# EAGLE design node (EAGLE 8.2.2)
MySensors node based on ATMEGA328P-PU
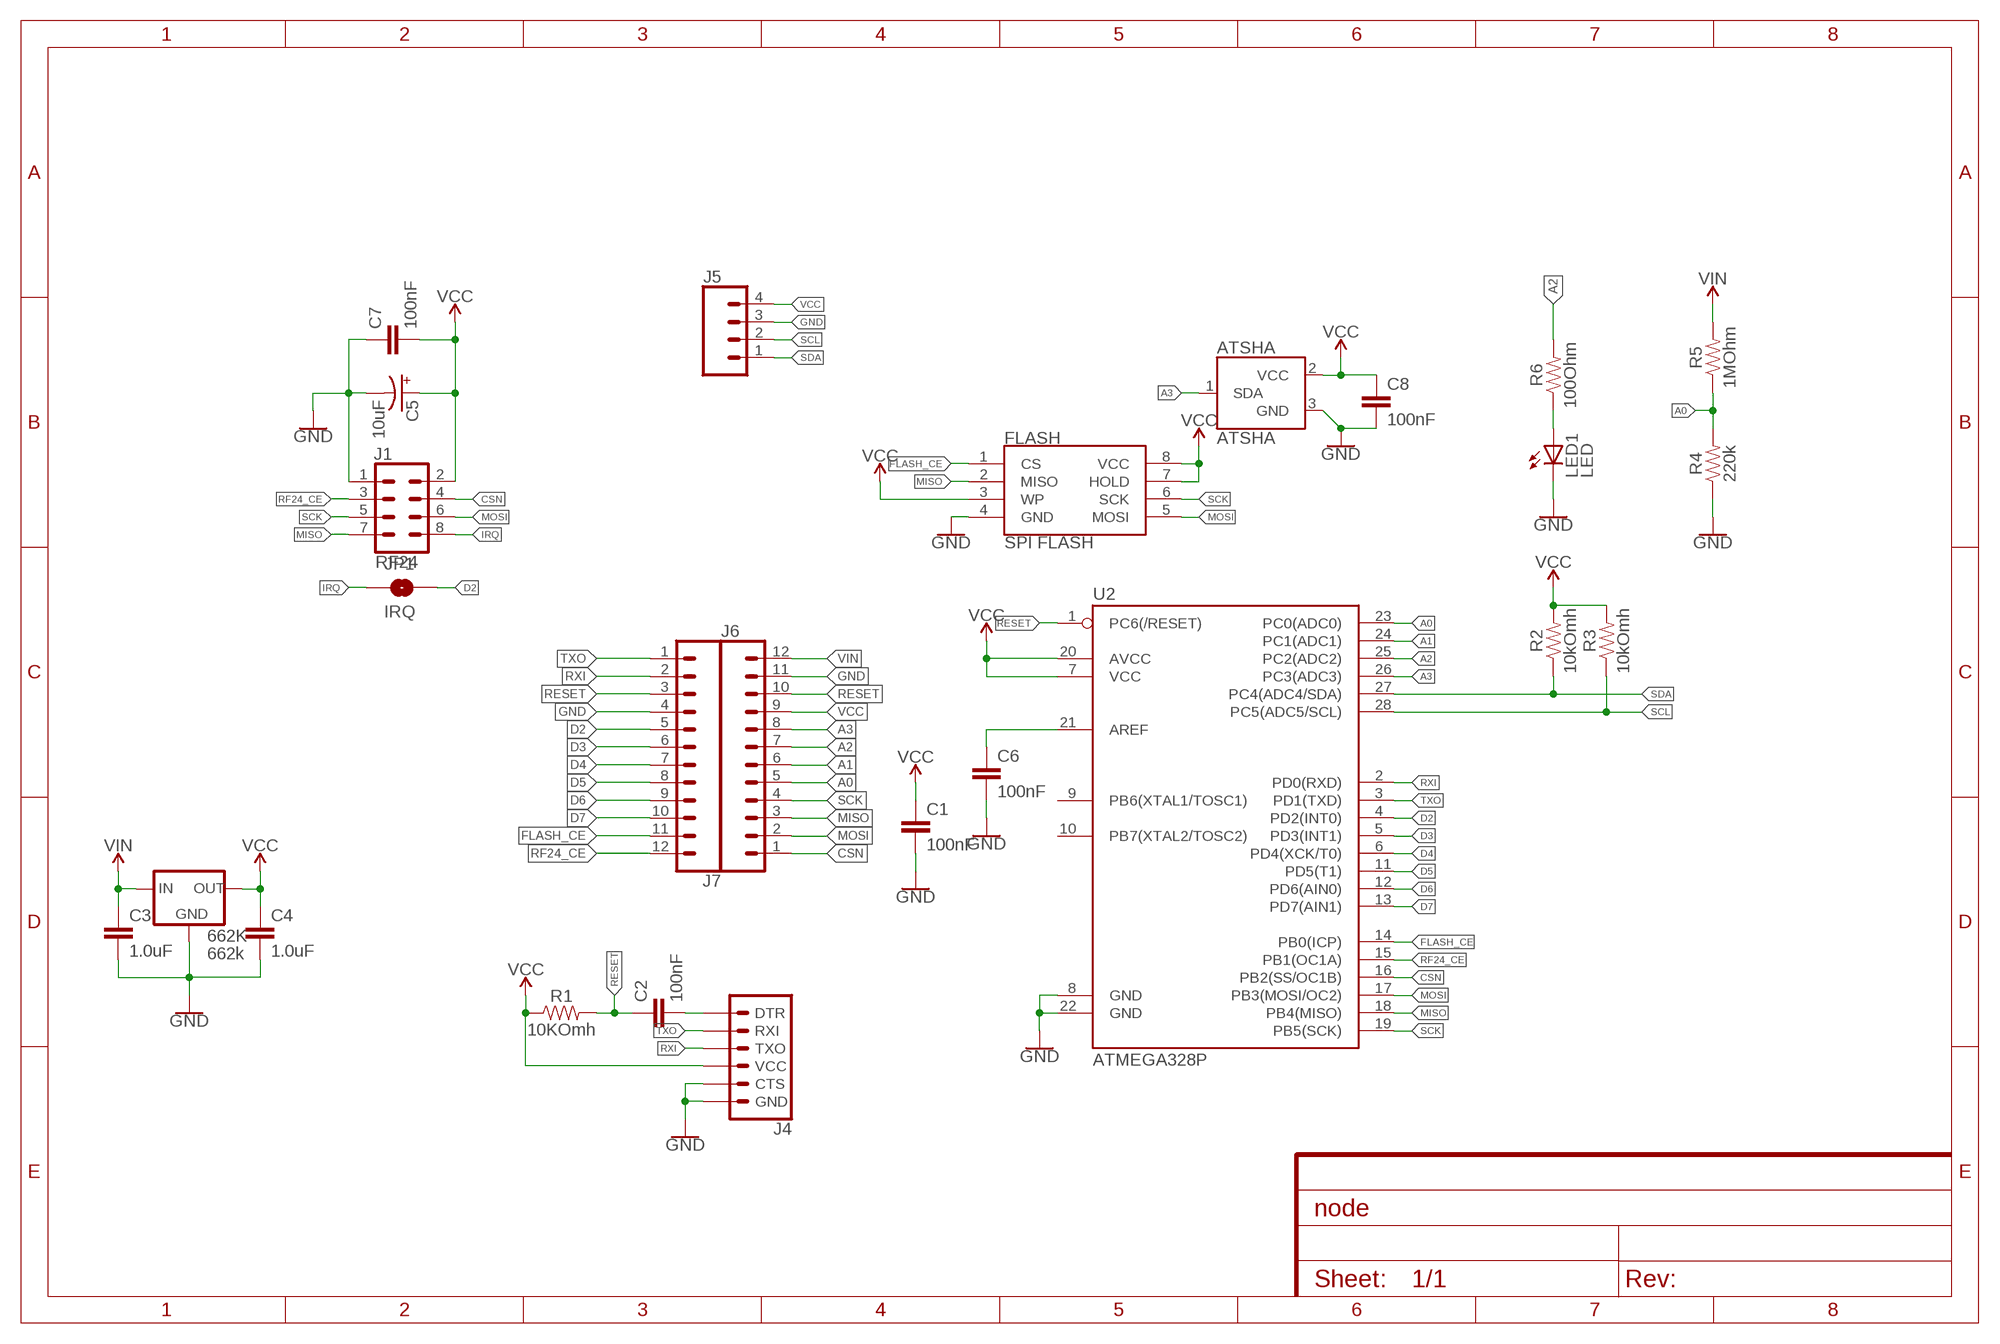
[diagram p0: schematic, sheet 1]

## Parts
662K  662k  XC63FPM  [SOT23]
ATSHA  ATSHA  ATSHA204-TSU  [SOT23-3]
C1  100nF  10UF-0805-10V-10%  [0805]
C2  100nF  10UF-0805-10V-10%  [0805]
C3  1.0uF  1.0UF-0805-25V-10%  [0805]
C4  1.0uF  1.0UF-0805-25V-10%  [0805]
C5  10uF  10UF-POLAR-RADIAL-2.5MM-25V-20%  [CPOL-RADIAL-2.5MM-5MM]
C6  100nF  10UF-0805-10V-10%  [0805]
C7  100nF  10UF-0805-10V-10%  [0805]
C8  100nF  10UF-0805-10V-10%  [0805]
FLASH  SPI FLASH  SPI_FLASH-X25XXSMD  [SO08]
J1  RF24  CONN_04X2  [2X4]
J4  6_PIN_SERIAL_TARGET  [1X06]
J5  CONN_04  [1X04]
J6  CONN_12  [1X12]
J7  CONN_12  [1X12]
JP1  IRQ  JUMPER-SMT_2_NO_NO-SILK  [SMT-JUMPER_2_NO_NO-SILK]
LED1  LED  LEDCHIP-LED0805  [CHIP-LED0805]
R1  10KOmh  RESISTOR0805  [0805]
R2  10kOmh  RESISTOR0805  [0805]
R3  10kOmh  RESISTOR0805  [0805]
R4  220k  RESISTOR0805  [0805]
R5  1MOhm  RESISTOR0805  [0805]
R6  100Ohm  0.22OHM-0805-1/4W-1%  [0805]
U2  ATMEGA328P  ATMEGA328P_PDIP  [DIP28]

## Nets
A0: J6.5 R4.2 R5.1 U2.23(PC0(ADC0))
A1: J6.6 U2.24(PC1(ADC1))
A2: J6.7 R6.2 U2.25(PC2(ADC2))
A3: ATSHA.1(SDA) J6.8 U2.26(PC3(ADC3))
CSN: J1.4 J6.1 U2.16(PB2(SS/OC1B))
D2: J7.5 JP1.2 U2.4(PD2(INT0))
D3: J7.6 U2.5(PD3(INT1))
D4: J7.7 U2.6(PD4(XCK/T0))
D5: J7.8 U2.11(PD5(T1))
D6: J7.9 U2.12(PD6(AIN0))
D7: J7.10 U2.13(PD7(AIN1))
FLASH_CE: FLASH.1(CS) J7.11 U2.14(PB0(ICP))
GND: 662K.1(GND) ATSHA.3(GND) C1.2 C3.2 C4.2 C5.2(-) C6.2 C7.1 C8.2 FLASH.4(GND) J1.1 J4.5(CTS) J4.6(GND) J5.3 J6.11 J7.4 LED1.C R4.1 U2.8(GND) U2.22(GND)
IRQ: J1.8 JP1.1
MISO: FLASH.2(MISO) J1.7 J6.3 U2.18(PB4(MISO))
MOSI: FLASH.5(MOSI) J1.6 J6.2 U2.17(PB3(MOSI/OC2))
N$1: C2.2 J4.1(DTR)
N$2: C6.1 U2.21(AREF)
N$3: LED1.A R6.1
RESET: C2.1 J6.10 J7.3 R1.2 U2.1(PC6(/RESET))
RF24_CE: J1.3 J7.12 U2.15(PB1(OC1A))
RXI: J4.3(TXO) J7.2 U2.2(PD0(RXD))
SCK: FLASH.6(SCK) J1.5 J6.4 U2.19(PB5(SCK))
SCL: J5.2 R3.1 U2.28(PC5(ADC5/SCL))
SDA: J5.1 R2.1 U2.27(PC4(ADC4/SDA))
TXO: J4.2(RXI) J7.1 U2.3(PD1(TXD))
VCC: 662K.2(OUT) ATSHA.2(VCC) C1.1 C4.1 C5.1(+) C7.2 C8.1 FLASH.3(WP) FLASH.7(HOLD) FLASH.8(VCC) J1.2 J4.4(VCC) J5.4 J6.9 R1.1 R2.2 R3.2 U2.7(VCC) U2.20(AVCC)
VIN: 662K.3(IN) C3.1 J6.12 R5.2
Unconnected: U2.9(PB6(XTAL1/TOSC1)) U2.10(PB7(XTAL2/TOSC2))

## Library data of the parts
662K = v-reg:XC63FP: Positiv Voltage Regulators www.torex.co.jp/english/product/pro02/pdf/0201_xc62fp.pdf
ATSHA = SparkFun-IC-Special-Function:ATSHA204: Atmel ATSHA204 The Atmel ATSHA204 is an optimized authentication chip that includes a 4.5Kb EEPROM. This array can be used for storage of keys, miscellaneous read/write, read-only, password or secret data, and consumption tracking. Access to the various sections of memory can be restricted in a variety of ways and then the configuration locked to prevent changes. Datasheet <http://www.atmel.com/Images/Atmel-8740-CryptoAuth-ATSHA204-Datasheet.pdf> SparkFun Products SparkFun Electric Imp Shield <https://www.sparkfun.com/products/12887> SparkFun Electric Imp Breakout <https://www.sparkfun.com/products/12886>; PROD_ID: IC-11208
C1 C2 C6-C8 = SparkFun-Capacitors:10UF: 10.0µF ceramic capacitors A capacitor is a passive two-terminal electrical component used to store electrical energy temporarily in an electric field.; PROD_ID: CAP-11330; VALUE: 10uF
C3 C4 = SparkFun-Capacitors:1.0UF: 1µF ceramic capacitors A capacitor is a passive two-terminal electrical component used to store electrical energy temporarily in an electric field.; PROD_ID: CAP-08064
C5 = SparkFun-Capacitors:10UF-POLAR: 10.0µF polarized capacitors A capacitor is a passive two-terminal electrical component used to store electrical energy temporarily in an electric field.; PROD_ID: CAP-08440
FLASH = SparkFun-IC-Memory:SPI_FLASH-X25XX: 32M Serial Flash Memory 8pin SPI Flash series x25xx. Works with devices like W25X32 and BR25L32 Datasheet <http://www.macronix.com/Lists/Datasheet/Attachments/5031/MX25L3206E,%203V,%2032Mb,%20v1.5.pdf> SparkFun Products SparkFun Venus GPS Logger <https://www.sparkfun.com/products/10920> (GPS-10920); PROD_ID: N/A; VALUE: 32M SPI Flash
J1 = SparkFun-Connectors:CONN_04X2: Multi connection point. Often used as Generic Header-pin footprint for 0.1 inch spaced/style header connections On any of the 0.1 inch spaced packages, you can populate with these: Break Away Headers - Straight <https://www.sparkfun.com/products/116> (PRT-00116) Break Away Male Headers - Right Angle <https://www.sparkfun.com/products/553> (PRT-00553) Female Headers <https://www.sparkfun.com/products/115> (PRT-00115) Break Away Headers - Machine Pin <https://www.sparkfun.com/products/117> (PRT-00117) Break Away Female Headers - Swiss Machine Pin <https://www.sparkfun.com/products/743> (PRT-00743)
J4 = SparkFun-Connectors:6_PIN_SERIAL_TARGET: 6-pin header connection for use with the "FTDI BASIC" pinout - TARGET SIDE. Also known as "Arduino Serial Program Header". It is used to mate with our FTDI Basic serial programmers using the Arduino IDE. Note, this device has "TARGET" in the name. It is intended to be used on a design that contains a target micro-controller that you wish to program. The "sister" device, named "CABLE" is inteneded to be used on a design that usually lives on the end of your USB cable and prvides the converter chip (FTDI232 or FTDI231x) to commnicate serial RX/TX. You can populate with some of these: Break Away Headers - Straight <https://www.sparkfun.com/products/116> (PRT-00116) For reference (or to suit your programming needs) check out these designs: SparkFun FTDI Basic Breakout - 5V <https://www.sparkfun.com/products/9716> (DEV-09716) SparkFun FTDI Basic Breakout - 3.3V <https://www.sparkfun.com/products/9873> (DEV-09873) SparkFun FTDI SmartBasic <https://www.sparkfun.com/products/12935> (DEV-12935) SparkFun Beefy 3 - FTDI Basic Breakout <https://www.sparkfun.com/products/13746> (DEV-13746)
J5 = SparkFun-Connectors:CONN_04: Multi connection point. Often used as Generic Header-pin footprint for 0.1 inch spaced/style header connections On any of the 0.1 inch spaced packages, you can populate with these: Break Away Headers - Straight <https://www.sparkfun.com/products/116> (PRT-00116) Break Away Male Headers - Right Angle <https://www.sparkfun.com/products/553> (PRT-00553) Female Headers <https://www.sparkfun.com/products/115> (PRT-00115) Break Away Headers - Machine Pin <https://www.sparkfun.com/products/117> (PRT-00117) Break Away Female Headers - Swiss Machine Pin <https://www.sparkfun.com/products/743> (PRT-00743) For SCREWTERMINALS and SPRING TERMINALS visit here: Screw Terimnals on SparkFun.com <https://www.sparkfun.com/search/results?term=Screw+Terminals> (5mm/3.5mm/2.54mm spacing) This device is also useful as a general connection point to wire up your design to another part of your project. Our various solder wires solder well into these plated through hole pads. Hook-Up Wire - Assortment (Stranded, 22 AWG) <https://www.sparkfun.com/products/11375> (PRT-11375) Hook-Up Wire - Assortment (Solid Core, 22 AWG) <https://www.sparkfun.com/products/11367> (PRT-11367) View the entire wire category on our website here <https://www.sparkfun.com/categories/141> Special notes: Molex polarized connector foot print use with SKU : PRT-08231 with associated crimp pins and housings. 1MM SMD Version SKU: PRT-10208; PROD_ID: CONN-09696
J6 J7 = SparkFun-Connectors:CONN_12: Multi connection point. Often used as Generic Header-pin footprint for 0.1 inch spaced/style header connections On any of the 0.1 inch spaced packages, you can populate with these: Break Away Headers - Straight <https://www.sparkfun.com/products/116> (PRT-00116) Break Away Male Headers - Right Angle <https://www.sparkfun.com/products/553> (PRT-00553) Female Headers <https://www.sparkfun.com/products/115> (PRT-00115) Break Away Headers - Machine Pin <https://www.sparkfun.com/products/117> (PRT-00117) Break Away Female Headers - Swiss Machine Pin <https://www.sparkfun.com/products/743> (PRT-00743) For SCREWTERMINALS and SPRING TERMINALS visit here: Screw Terimnals on SparkFun.com <https://www.sparkfun.com/search/results?term=Screw+Terminals> (5mm/3.5mm/2.54mm spacing) This device is also useful as a general connection point to wire up your design to another part of your project. Our various solder wires solder well into these plated through hole pads. Hook-Up Wire - Assortment (Stranded, 22 AWG) <https://www.sparkfun.com/products/11375> (PRT-11375) Hook-Up Wire - Assortment (Solid Core, 22 AWG) <https://www.sparkfun.com/products/11367> (PRT-11367) View the entire wire category on our website here <https://www.sparkfun.com/categories/141> Special notes: Molex polarized connector foot print use with SKU : PRT-08231 with associated crimp pins and housings. 1MM SMD Version SKU: PRT-10208 NOTES ON THE VARIANTS LOCK and LOCK_LONGPADS... This footprint was designed to help hold the alignment of a through-hole component (i.e. 6-pin header) while soldering it into place. You may notice that each hole has been shifted either up or down by 0.005 of an inch from it's more standard position (which is a perfectly straight line). This slight alteration caused the pins (the squares in the middle) to touch the edges of the holes. Because they are alternating, it causes a "brace" to hold the component in place. 0.005 has proven to be the perfect amount of "off-center" position when using our standard breakaway headers. Although looks a little odd when you look at the bare footprint, once you have a header in there, the alteration is very hard to notice. Also,if you push a header all the way into place, it is covered up entirely on the bottom side.
JP1 = SparkFun-Jumpers:JUMPER-SMT_2_NO: Normally open jumper This jumper has two pads in close proximity to each other. Apply solder to close the connection. Round pads are easier to solder for beginners, but are a lot larger. SparkFun Product that uses the round pads: SparkFun EL Sequencer <https://www.sparkfun.com/products/12781>
LED1 = led:LED: LED OSRAM: - CHIPLED LG R971, LG N971, LY N971, LG Q971, LY Q971, LO R971, LY R971 LH N974, LH R974 LS Q976, LO Q976, LY Q976 LO Q996 - Hyper CHIPLED LW Q18S LB Q993, LB Q99A, LB R99A - SideLED LS A670, LO A670, LY A670, LG A670, LP A670 LB A673, LV A673, LT A673, LW A673 LH A674 LY A675 LS A676, LA A676, LO A676, LY A676, LW A676 LS A679, LY A679, LG A679 - Hyper Micro SIDELED® LS Y876, LA Y876, LO Y876, LY Y876 LT Y87S - SmartLED LW L88C, LW L88S LB L89C, LB L89S, LG L890 LS L89K, LO L89K, LY L89K LS L896, LA L896, LO L896, LY L896 - TOPLED LS T670, LO T670, LY T670, LG T670, LP T670 LSG T670, LSP T670, LSY T670, LOP T670, LYG T670 LG T671, LOG T671, LSG T671 LB T673, LV T673, LT T673, LW T673 LH T674 LS T676, LA T676, LO T676, LY T676, LB T676, LH T676, LSB T676, LW T676 LB T67C, LV T67C, LT T67C, LS T67K, LO T67K, LY T67K, LW E67C LS E67B, LA E67B, LO E67B, LY E67B, LB E67C, LV E67C, LT E67C LW T67C LS T679, LY T679, LG T679 LS T770, LO T770, LY T770, LG T770, LP T770 LB T773, LV T773, LT T773, LW T773 LH T774 LS E675, LA E675, LY E675, LS T675 LS T776, LA T776, LO T776, LY T776, LB T776 LHGB T686 LT T68C, LB T68C - Hyper Mini TOPLED® LB M676 - Mini TOPLED Santana® LG M470 LS M47K, LO M47K, LY M47K Source: http://www.osram.convergy.de LUXEON: - LUMILED® LXK2-PW12-R00, LXK2-PW12-S00, LXK2-PW14-U00, LXK2-PW14-V00 LXK2-PM12-R00, LXK2-PM12-S00, LXK2-PM14-U00 LXK2-PE12-Q00, LXK2-PE12-R00, LXK2-PE12-S00, LXK2-PE14-T00, LXK2-PE14-U00 LXK2-PB12-K00, LXK2-PB12-L00, LXK2-PB12-M00, LXK2-PB14-N00, LXK2-PB14-P00, LXK2-PB14-Q00 LXK2-PR12-L00, LXK2-PR12-M00, LXK2-PR14-Q00, LXK2-PR14-R00 LXK2-PD12-Q00, LXK2-PD12-R00, LXK2-PD12-S00 LXK2-PH12-R00, LXK2-PH12-S00 LXK2-PL12-P00, LXK2-PL12-Q00, LXK2-PL12-R00 Source: www.luxeon.com KINGBRIGHT: KA-3528ASYC Source: www.kingbright.com
R1-R5 = SparkFun-Resistors:RESISTOR: Generic Resistor Package
R6 = SparkFun-Resistors:0.22OHM: 0.22Ω resistor A resistor is a passive two-terminal electrical component that implements electrical resistance as a circuit element. Resistors act to reduce current flow, and, at the same time, act to lower voltage levels within circuits. - Wikipedia; PROD_ID: RES-09883; VALUE: 0.22
U2 = SparkFun-IC-Microcontroller:ATMEGA328P_PDIP: Atmel 328P Through hole ATMEGA328P uC used in the Arduino 32kb flash, 1k EEPROM, 2k SRAM Datasheet <http://www.sparkfun.com/datasheets/Components/SMD/ATMega328.pdf> SparkFun Products Storefront component: AVR 28 Pin 20MHz 32K 6A/D - ATMega328P <https://www.sparkfun.com/products/9061> (COM-09061) SparkFun Simon Says - Through-Hole Soldering Kit <https://www.sparkfun.com/products/10547> (KIT-10547) SparkFun Learn to Solder - Simon Says <https://www.sparkfun.com/products/13708> (KIT-13708) SparkFun BigTime Watch Kit <https://www.sparkfun.com/products/11734> (KIT-11734) SparkFun ClockIt <https://www.sparkfun.com/products/10930> (KIT-10930) SparkFun Serial Enabled LCD Kit <https://www.sparkfun.com/products/10097> (LCD-10097) SparkFun Simon Tilts - Through Hole Soldering Kit <https://www.sparkfun.com/products/12634> (KIT-12634) SparkFun Frequency Counter Kit <https://www.sparkfun.com/products/10140> (KIT-10140) FabFM Radio Kit <https://www.sparkfun.com/products/11043> (KIT-11043) SparkFun Binary Blaster Kit <https://www.sparkfun.com/products/12037> (KIT-12037) SparkFun Metro-Gnome <https://www.sparkfun.com/products/9236> (KIT-09236) ATmega328 with Arduino Optiboot (Uno) <https://www.sparkfun.com/products/10524> (DEV-10524); PROD_ID: IC-09136; VALUE: 328P

## Net classes
0 default: clearance 0.205 mm

## Board
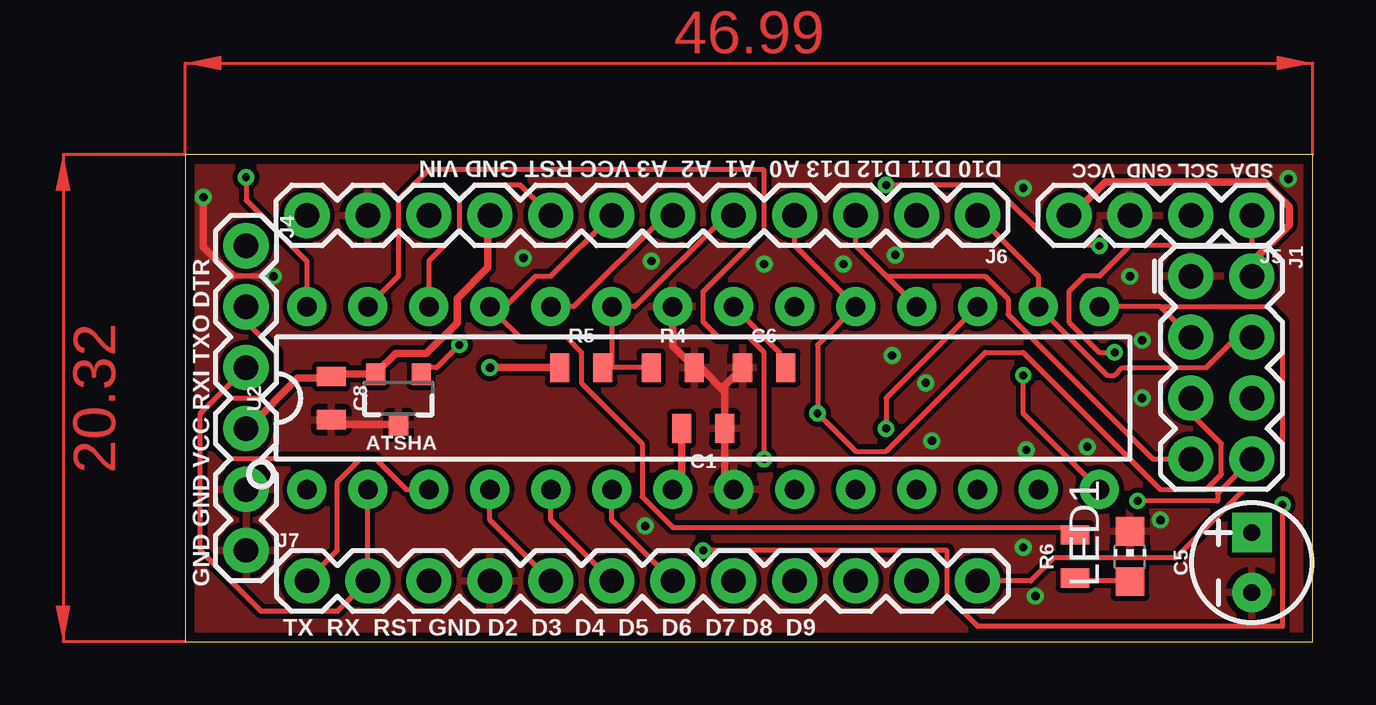
[diagram p1: board, top side]
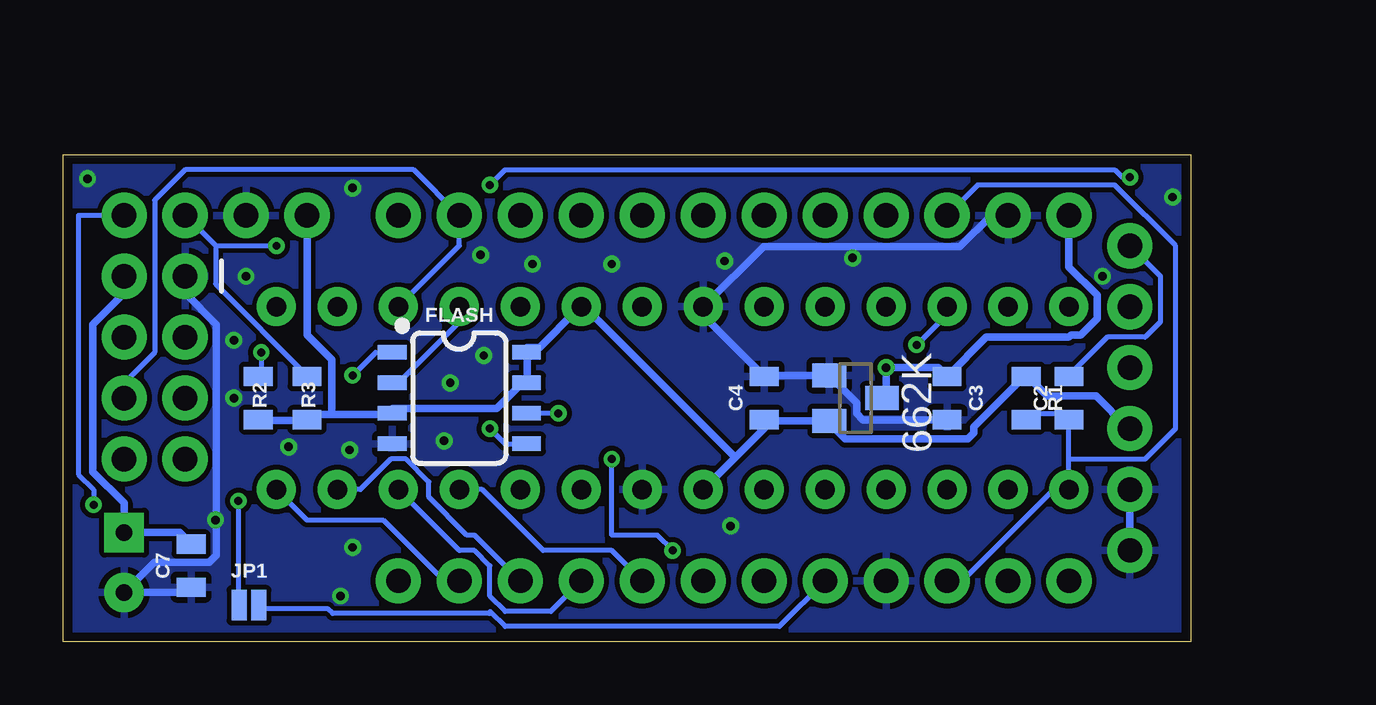
[diagram p2: board, bottom side, seen from below]

Size 46.99 x 20.32 mm. Coordinates in mm from the lower left corner, seen from the top.
Outline: 0,0 46.99,0 46.99,20.32 0,20.32 0,0
Copper layers (1*16): Top 0.0356mm / dielectric 1.5011mm / Bottom 0.0356mm
Design rules "oshpark-2layer": minimum track width 6mil, minimum drill 13mil, track to track 6mil, track to pad 6mil, pad to pad 6mil, via to via 6mil, smd to smd 6mil, copper to edge 15mil, drill to drill 6mil, minimum pad ring 7mil, minimum via ring 7mil, stop-mask expansion 2.5mil, vias tented up to drill 0mil, thermal gap 10mil

### Footprints (pad centres in the part's own frame; a part is rotated, then mirrored left to right if it is on the bottom)
SOT23 = smd 1 x 1.4: 1 -0.95,-1.1; 2 0.95,-1.1; 3 0,1.1
SOT23-3 = smd 0.8 x 0.9: 1 -0.95,-1; 2 0.95,-1; 3 0,1.1
0805 = smd 0.8 x 1.2: 1 -0.9,0; 2 0.9,0
CPOL-RADIAL-2.5MM-5MM = drill 0.7 pad 1.651 square: 1 1.25,0 | drill 0.7 pad 1.651: 2 -1.25,0
SO08 = smd 0.6 x 1.2: 1 -1.905,-2.8; 2 -0.635,-2.8; 3 0.635,-2.8; 4 1.905,-2.8; 5 1.905,2.8; 6 0.635,2.8; 7 -0.635,2.8; 8 -1.905,2.8
2X4 = drill 1.016 pad 1.88: 1 -3.81,-1.27; 2 -3.81,1.27; 3 -1.27,-1.27; 4 -1.27,1.27; 5 1.27,-1.27; 6 1.27,1.27; 7 3.81,-1.27; 8 3.81,1.27
1X06 = drill 1.016 pad 1.88: 1 0,0; 2 2.54,0; 3 5.08,0; 4 7.62,0; 5 10.16,0; 6 12.7,0
1X04 = drill 1.016 pad 1.88: 1 0,0; 2 2.54,0; 3 5.08,0; 4 7.62,0
1X12 = drill 1.016 pad 1.88: 1 0,0; 2 2.54,0; 3 5.08,0; 4 7.62,0; 5 10.16,0; 6 12.7,0; 7 15.24,0; 8 17.78,0; 9 20.32,0; 10 22.86,0; 11 25.4,0; 12 27.94,0
SMT-JUMPER_2_NO_NO-SILK = smd 0.635 x 1.27: 1 -0.406,0; 2 0.406,0
CHIP-LED0805 = smd 1.2 x 1.2: A 0,-1.05; C 0,1.05
DIP28 = drill 0.813 pad 1.626: 1 -16.51,-3.81; 2 -13.97,-3.81; 3 -11.43,-3.81; 4 -8.89,-3.81; 5 -6.35,-3.81; 6 -3.81,-3.81; 7 -1.27,-3.81; 8 1.27,-3.81; 9 3.81,-3.81; 10 6.35,-3.81; 11 8.89,-3.81; 12 11.43,-3.81; 13 13.97,-3.81; 14 16.51,-3.81; 15 16.51,3.81; 16 13.97,3.81; 17 11.43,3.81; 18 8.89,3.81; 19 6.35,3.81; 20 3.81,3.81; 21 1.27,3.81; 22 -1.27,3.81; 23 -3.81,3.81; 24 -6.35,3.81; 25 -8.89,3.81; 26 -11.43,3.81; 27 -13.97,3.81; 28 -16.51,3.81

### Placement (x,y rotation side)
662K  13.97,10.16 270 bottom
ATSHA  8.89,10.16 180 top
C1  21.59,8.89 0 top
C2  5.08,10.16 90 bottom
C3  10.16,10.16 270 bottom
C4  17.78,10.16 90 bottom
C5  44.45,3.3 90 top
C6  24.13,11.43 180 top
C7  41.66,3.17 90 bottom
C8  6.1,10.16 270 top
FLASH  30.48,10.16 270 bottom
J1  43.18,11.43 270 top
J4  2.54,16.51 270 top
J5  44.45,17.78 180 top
J6  33.02,17.78 180 top
J7  5.08,2.54 0 top
JP1  39.24,1.52 0 bottom
LED1  39.37,3.56 0 top
R1  6.86,10.16 270 bottom
R2  38.86,10.16 270 bottom
R3  36.83,10.16 270 bottom
R4  20.32,11.43 180 top
R5  16.51,11.43 180 top
R6  37.08,3.56 90 top
U2  21.59,10.16 0 top

### Tracks (layer width: path | path; a pad name or v marks a point on that pad's centre or on a via)
A0
  Top 0.203: R4.2 17.78,11.43 | 17.78,11.43 U2.23 18.73,13.97 22.54,17.78 J6.5 | 17.78,11.43 R5.1
A1
  Top 0.203: U2.24 16.19,13.97 20,17.78 J6.6
A2
  Top 0.203: 13.02,13.65 13.97,12.7 15.88,12.7 16.51,12.06 16.51,10.79 19.05,8.26 19.05,6.03 20.32,4.76 36.83,4.76 R6.2 | J6.7 15.24,15.24 14.61,15.24 13.02,13.65 | 13.02,13.65 U2.25
A3  (via drill 0.33)
  Top 0.203: v11.43,12.38 10.48,11.43 9.84,11.43 ATSHA.1 | U2.26 10.16,15.88 11.43,17.14 11.43,18.41 12.06,19.05 13.97,19.05 J6.8
  Bottom 0.203: v11.43,12.38 10.16,13.65 U2.26
CSN
  Top 0.203: J6.1 35.56,15.24 U2.16 38.42,11.11 38.73,11.11 39.05,11.43 42.55,11.43 43.81,12.7 J1.4
D2
  Top 0.203: U2.4 12.7,5.08 J7.5
  Bottom 0.203: 29.18,1.24 28.57,0.64 17.14,0.64 J7.5 | 29.18,1.24 29.21,1.27 | 38.73,1.27 JP1.2 38.82,1.38 35.97,1.38 35.76,1.18 29.23,1.18 29.18,1.24
D3
  Top 0.203: U2.5 15.24,5.08 J7.6
D4
  Top 0.203: U2.6 17.78,5.08 J7.7
D5
  Bottom 0.203: U2.11 29.53,6.35 26.99,3.81 24.13,3.81 J7.8
D6
  Bottom 0.203: U2.12 30.48,3.81 29.84,3.81 29.21,3.17 29.21,1.91 28.57,1.27 26.67,1.27 J7.9
D7
  Bottom 0.203: U2.13 34.61,6.35 33.34,7.62 32.7,7.62 31.75,6.67 31.75,6.03 30.16,4.45 29.84,4.45 J7.10
FLASH_CE  (via drill 0.33)
  Top 0.203: v34.92,11.11 34.92,9.53 U2.14
  Bottom 0.203: FLASH.1 33.97,12.06 v34.92,11.11 | J7.11 31.11,2.54 33.66,5.08 36.83,5.08 U2.14
GND  (via drill 0.35)
  Top 0.203: v3.68,15.24 3.66,15.26 2.02,15.26 0.76,16.52 v0.76,18.54 | LED1.C 39.37,4.45 39.22,4.46
  Top 0.305: U2.8 22.49,6.72 C1.2 22.49,10.42 | 22.49,10.42 22.49,10.69 C6.2 | 22.49,10.42 21.48,11.43 R4.1 20.32,12.33 U2.22 | ATSHA.3 6.3,9.06 C8.2 | v0.76,18.54 0.76,16.45 1.98,15.24
  Bottom 0.305: J6.11 8.32,17.78 9.62,16.48 17.81,16.48 U2.22 20.32,13.6 C4.2 17.73,11.11 662K.1 13.93,9.97 13.93,9.51 13.68,9.26 C3.2 | J4.5 J4.6 | J1.1 41.91,14.54 40.61,13.24 40.61,3.61 40.91,3.32 43.18,3.32 C5.2 41.88,2.05 C7.1
  other vias: 39.37,15.24 40.64,5.08 39.88,12.57 39.88,10.16 35.05,8 31.11,8.38 29.46,11.94 14.1,16 19.43,15.88 24.13,15.75 27.43,15.75 35.43,1.91 34.92,3.94 19.18,4.83 37.59,8.13 30.86,10.79 45.97,19.3 34.92,18.92 29.59,16.13
  pour Top: 0,20.32 46.99,20.32 46.99,0 0,0
  pour Bottom: 0,20.32 46.99,20.32 46.99,0 0,0
IRQ  (via drill 0.33)
  Top 0.203: v39.69,5.87 43.02,5.87 43.02,6.19 J1.8
  Bottom 0.203: v39.69,5.87 39.69,1.59 JP1.1
MISO
  Top 0.203: J6.3 27.94,16.51 29.21,15.24 | U2.18 29.21,15.24 | J1.7 40.32,7.62 34.29,13.65 34.29,14.29 33.34,15.24 29.21,15.24
  Bottom 0.203: U2.18 30.48,13.34 33.02,10.79 FLASH.2
MOSI  (via drill 0.33)
  Top 0.203: v29.21,8.89 29.21,10.16 U2.17
  Bottom 0.203: FLASH.5 28.57,8.26 v29.21,8.89 | U2.17 30.48,16.51 J6.2 32.38,19.68 41.91,19.68 43.18,18.41 43.18,12.06 44.45,10.79 J1.6
N$1
  Bottom 0.203: J4.1 1.27,15.24 1.27,13.34 1.91,12.7 3.49,12.7 5.08,11.11 C2.2
N$2
  Top 0.203: U2.21 24.77,12.06 24.77,11.43 C6.1
N$3
  Top 0.203: R6.1 37.15,2.54 39.37,2.54 LED1.A
RESET
  Bottom 0.203: R1.2 6.67,9.53 5.08,9.53 C2.1 5.08,7.62 | 5.08,6.99 5.08,7.62 | J7.3 9.53,2.54 5.08,6.99 | 5.08,6.99 U2.1 | J6.10 8.89,19.05 3.17,19.05 0.64,16.51 0.64,8.89 1.91,7.62 5.08,7.62
RF24_CE
  Top 0.203: 40.64,13.97 U2.15 | J1.3 40.64,13.97 | J7.12 35.24,2.54 36.2,3.49 41.27,3.49 44.13,6.35 45.09,6.35 45.72,6.99 45.72,13.34 45.09,13.97 40.64,13.97
RXI
  Top 0.203: U2.2 J7.2 6.35,1.27 3.17,1.27 0.64,3.81 0.64,9.53 J4.3
SCK  (via drill 0.33)
  Top 0.203: J6.4 25.4,16.51 U2.19 26.35,12.38 v26.35,9.53 27.94,7.94 29.21,7.94 33.34,12.06 34.92,12.06 40.64,6.35 42.55,6.35 43.18,6.99 43.18,8.26 41.91,9.53 J1.5
  Bottom 0.203: v26.35,9.53 FLASH.6
SCL  (via drill 0.33)
  Top 0.203: U2.28 5.08,15.88 2.54,18.41 v2.54,19.37 | v29.21,19.05 33.66,19.05 36.2,16.51 v38.1,16.51
  Bottom 0.203: 40.64,16.51 40.64,14.92 36.83,11.11 R3.1 | J5.2 40.64,16.51 | v2.54,19.37 2.86,19.37 3.17,19.68 28.57,19.68 v29.21,19.05 | 40.64,16.51 v38.1,16.51
SDA  (via drill 0.33)
  Top 0.203: v38.73,12.06 38.1,12.06 36.83,13.34 36.83,14.61 37.47,15.24 38.1,15.24 39.37,16.51 44.45,16.51 J5.1 | U2.27 8.89,15.24 8.89,18.41 10.16,19.68 24.13,19.68 24.13,17.14 21.59,14.61 21.59,13.34 22.23,12.7 23.5,12.7 24.13,12.06 v24.13,7.62 | v21.59,3.81 31.75,3.81 31.75,1.91 33.02,0.64 45.72,0.64 v45.72,5.71
  Bottom 0.203: v38.73,12.06 38.73,11.43 R2.1 | v24.13,7.62 24.13,4.45 22.23,4.45 v21.59,3.81 | v45.72,5.71 45.72,6.35 46.35,6.99 46.35,17.78 J5.1
TXO
  Top 0.203: U2.3 9.21,6.35 7.94,7.62 7.3,7.62 | 7.3,7.62 6.35,6.67 6.35,3.81 J7.1 | J4.2 2.54,13.34 3.81,12.06 3.81,10.79 3.17,10.16 1.91,10.16 1.27,9.53 1.27,8.26 1.91,7.62 7.3,7.62
VCC
  Top 0.305: C1.1 20.69,6.72 U2.7 | J4.4 2.67,8.97 4.71,11.01 5.98,11.01 C8.1 6.2,11.16 ATSHA.2 8.02,11.26 8.78,12.03 10.06,12.03 11.33,13.3 11.33,14.32 12.61,15.59 12.61,17.63 J6.9 | J1.2 44.47,15.34 44.47,15.85 46,17.38 46,18.14 44.98,19.16 38.35,19.16 37.08,17.89 J5.4
  Bottom 0.305: 18.98,7.69 17.78,8.89 C4.1 17.73,9.21 662K.2 14.9,8.97 14.39,8.46 9.29,8.46 9.04,8.71 9.04,8.97 7,11.01 R1.1 6.74,11.01 5.98,10.24 3.94,10.24 2.67,8.97 J4.4 | 18.98,7.69 U2.7 | J1.2 44.45,14.54 45.75,13.24 45.75,7.08 44.45,5.79 C5.1 42.13,4.55 C7.2 | R2.2 38.86,9.22 37.08,9.22 R3.2 36.82,9.48 35.8,9.48 | 35.8,9.48 33.51,9.48 FLASH.3 33.25,9.73 28.92,9.73 27.9,10.75 FLASH.7 27.65,11.01 27.65,12.03 FLASH.8 27.65,12.28 27.14,12.28 25.61,13.81 U2.20 25.35,14.06 18.98,7.69 | 35.8,9.48 35.8,11.77 36.82,12.79 36.82,17.63 J5.4
VIN  (via drill 0.35)
  Top 0.305: R5.2 v12.7,11.43
  Bottom 0.305: 662K.3 12.7,10.33 v12.7,11.43 10.53,11.43 C3.1 8.52,12.7 5.08,12.7 4.98,12.8 4.59,12.8 3.91,13.48 3.91,14.46 5.08,15.62 J6.12
(copper drawn outside any net)
  shapes: Top area x2

### Text on the board
tSilk: D10 D11 D12 D13 A0 A1 A2 A3 VCC RST GND VIN | SDA SCL GND VCC | GND GND VCC RXI TXO DTR | TX RX RST GND D2 D3 D4 D5 D6 D7 D8 D9